# EAGLE design keychain_rev4 (EAGLE 9.6.2)
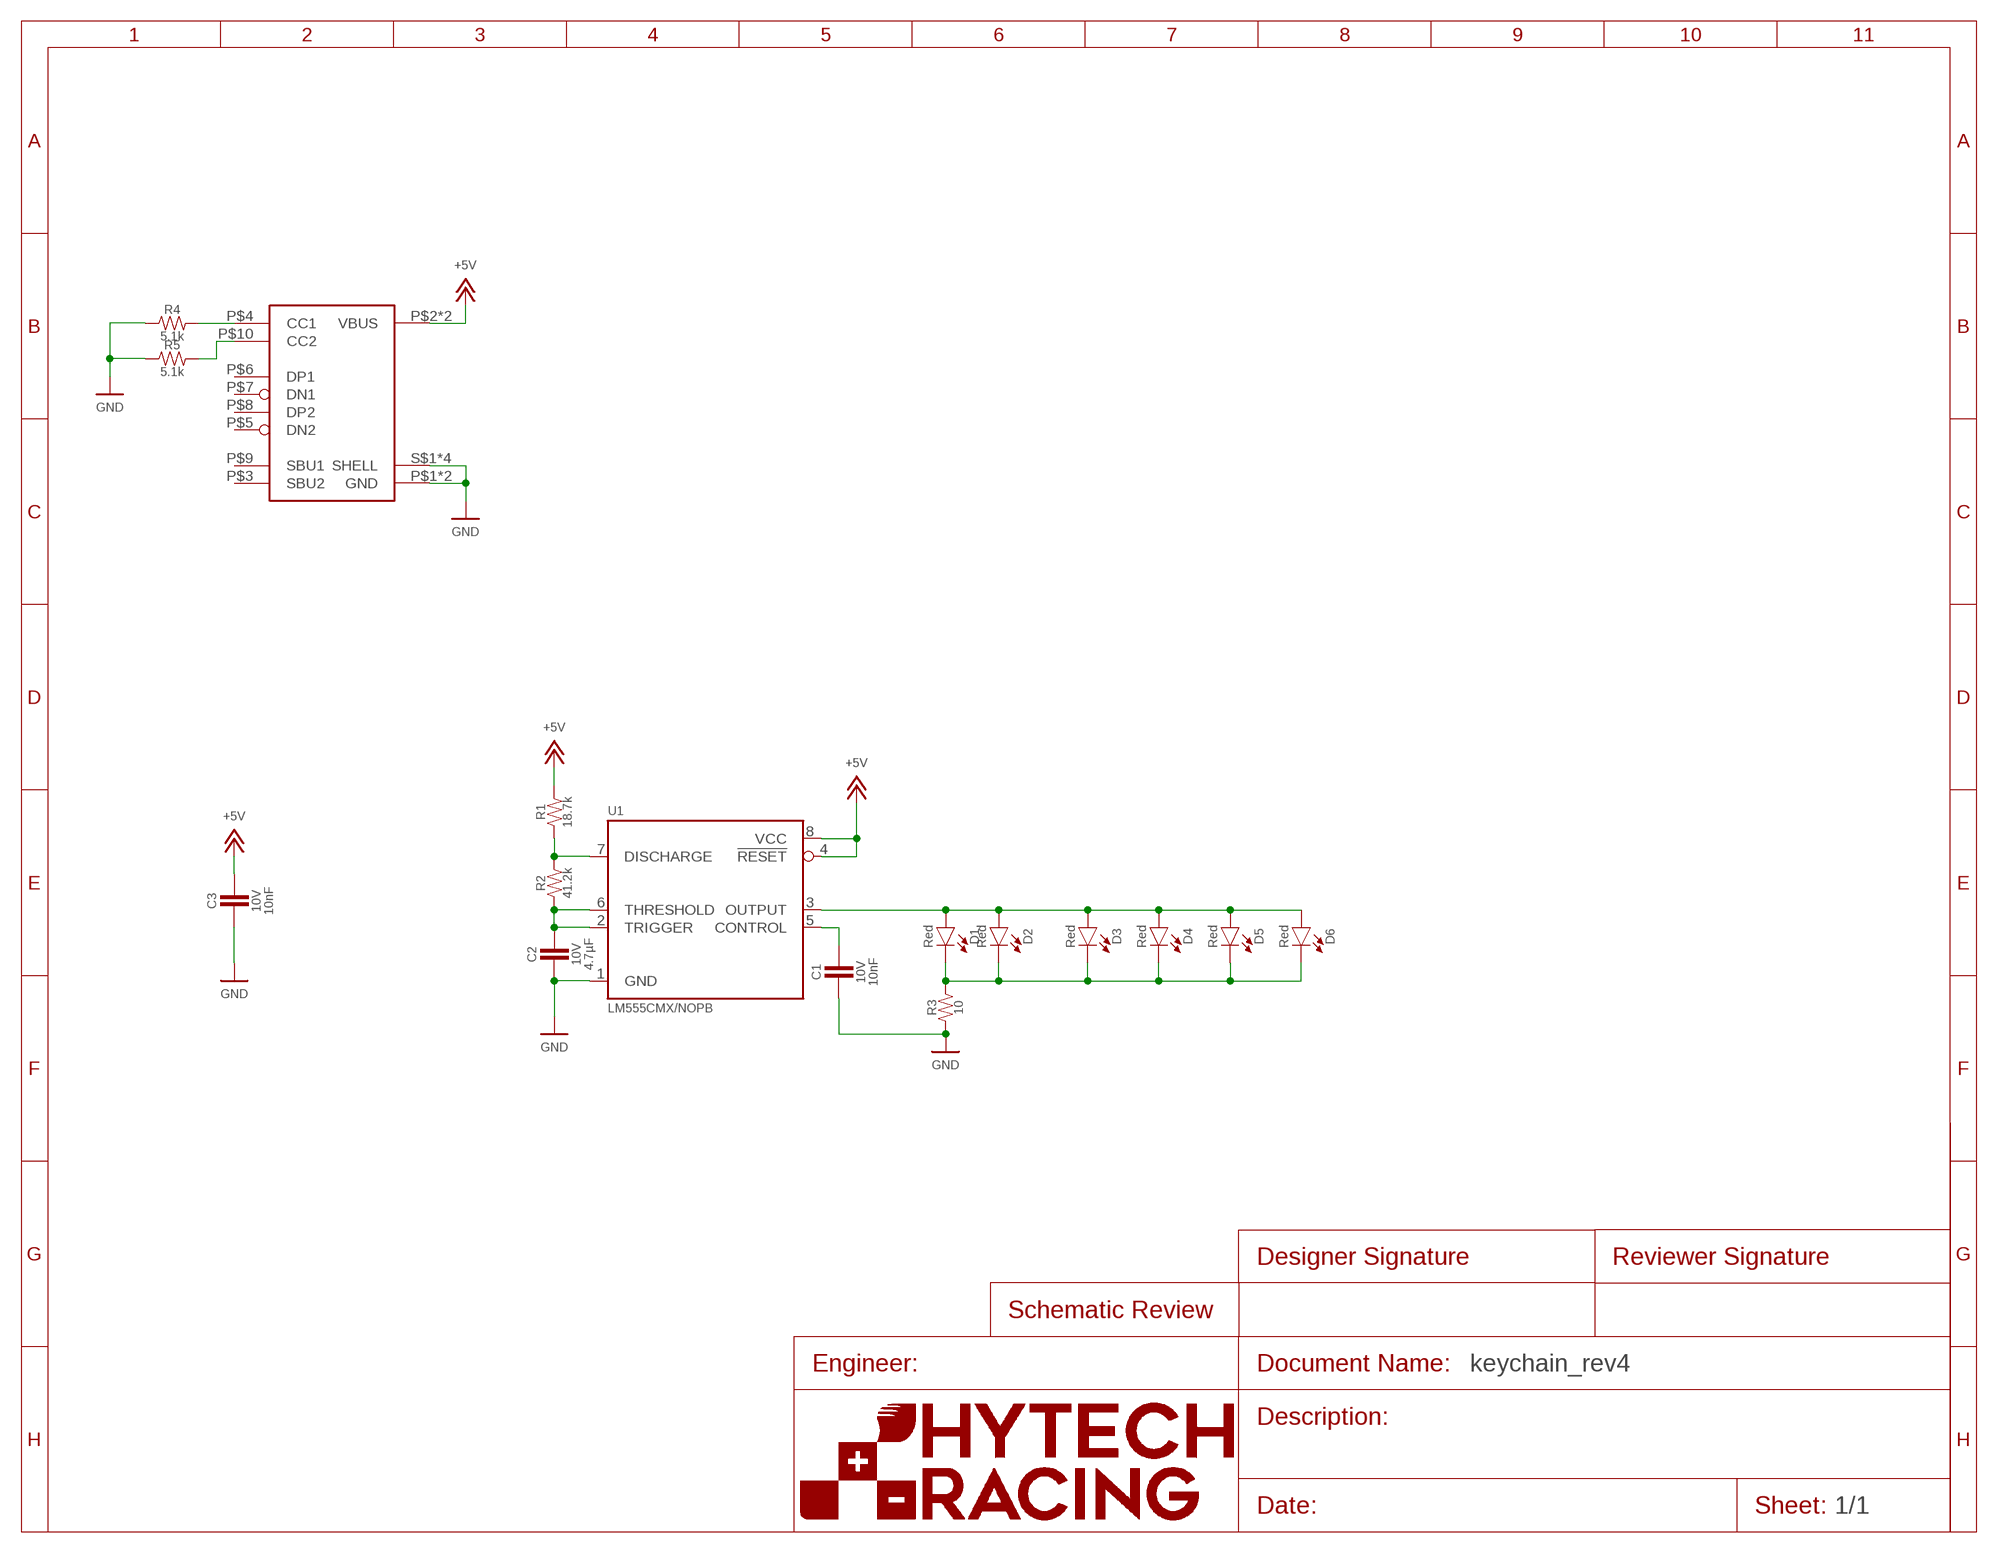
[diagram p0: schematic, sheet 1]

## Parts
C1  CAPACITOR_0603_10V_10NF  [0603-CAP]
C2  CAPACITOR_0603_10V_4.7UF  [0603-CAP]
C3  CAPACITOR_0603_10V_10NF  [0603-CAP]
D1  LED_0603_RED  [0603-LED]
D2  LED_0603_RED  [0603-LED]
D3  LED_0603_RED  [0603-LED]
D4  LED_0603_RED  [0603-LED]
D5  LED_0603_RED  [0603-LED]
D6  LED_0603_RED  [0603-LED]
J1  USB4110  [USB4110]
R1  RESISTOR_0603_18.7K  [0603-RES]
R2  RESISTOR_0603_41.2K  [0603-RES]
R3  RESISTOR_0603_10  [0603-RES]
R4  RESISTOR_0603_5.1K  [0603-RES]
R5  RESISTOR_0603_5.1K  [0603-RES]
U1  LM555  [SOIC-08(NARROW,0.15")]

## Nets
+5V: C3.1 J1.P$2(VBUS) J1.P$11(VBUS) R1.2 U1.4(!RESET) U1.8(VCC)
GND: C1.2 C2.2 C3.2 J1.P$1(GND) J1.P$12(GND) J1.S$1(SHELL) J1.S$2(SHELL) J1.S$3(SHELL) J1.S$4(SHELL) R3.1 R4.1 R5.1 U1.1(GND)
N$1: C1.1 U1.5(CONTROL)
N$2: D1.2(A) D2.2(A) D3.2(A) D4.2(A) D5.2(A) D6.2(A) U1.3(OUTPUT)
N$3: D1.1(C) D2.1(C) D3.1(C) D4.1(C) D5.1(C) D6.1(C) R3.2
N$4: J1.P$4(CC1) R4.2
N$5: J1.P$10(CC2) R5.2
N$6: C2.1 R2.1 U1.2(TRIGGER) U1.6(THRESHOLD)
N$8: R1.1 R2.2 U1.7(DISCHARGE)
Unconnected: J1.P$3(SBU2) J1.P$5(DN2) J1.P$6(DP1) J1.P$7(DN1) J1.P$8(DP2) J1.P$9(SBU1)

## Library data of the parts
C1 C3 = HyTechDevices:CAPACITOR_?_*: Capacitor, Non-Polarized VJ...1BC Series Datasheet <https://www.mouser.com/datasheet/2/427/vjw1bcbascomseries-1762447.pdf> Samsung Datasheet <https://www.mouser.com/datasheet/2/585/MLCC-1837944.pdf> Samsung Automotive MLCC Datasheet <https://www.mouser.com/datasheet/2/585/MLCC_Automotive-1837966.pdf> Walsin Datasheet <https://www.mouser.com/datasheet/2/210/WTC_MLCC_General_Purpose-1534899.pdf> GRM188R61A226ME15D <https://www.mouser.com/datasheet/2/281/1/GRM188R61A226ME15_02A-1985787.pdf> GRM188R61E106MA73D <https://www.mouser.com/datasheet/2/281/1/GRM188R61E106MA73_01A-1985806.pdf> 885012006013 <https://www.mouser.com/datasheet/2/445/885012006013-1726946.pdf> 2220Y6300105KXTWS2 <https://www.mouser.com/datasheet/2/218/SMD_High_and_Std_StackiCap_P62-1825512.pdf> Yageo Class 2, X5R <https://www.mouser.com/datasheet/2/447/UPY_GPHC_X5R_4V_to_50V_26-1827097.pdf> TDK C Series <https://www.mouser.com/ProductDetail/TDK/C3216X5R1V226M160AC?qs=%2Fha2pyFadujbcx9jh7lYl%2F4NeMoXFhdc8AqVWNq4wW6M2y7zl6GzBuhgtI0ngznN> AVX Automotive MLCC <https://www.mouser.com/datasheet/2/40/AutoMLCC-777028.pdf> KEMET X7R Series <https://www.mouser.com/datasheet/2/212/KEM_C1002_X7R_SMD-1102033.pdf> Kyocera AVX <https://www.mouser.com/datasheet/2/40/C0GNP0_Dielectric-951274.pdf> GRM21BR61H <https://www.mouser.com/datasheet/2/281/1/GRM21BR61H106KE43_01A-1986884.pdf> C1812W104KDRACTU <https://www.mouser.com/datasheet/2/212/KEM_C1034_X7R_HV_ARC_SMD-1101730.pdf> CGA series - MLCC Automotive grade <https://product.tdk.com/system/files/dam/doc/product/capacitor/ceramic/mlcc/catalog/mlcc_automotive_general_en.pdf>; CAPACITANCE: 10nF; DKPN: 311-4054-1-ND; MANUFACTURER: Yageo; MOPN: 603-CC603KRX7R6BB103; MPN: CC0603KRX7R6BB103; TOLERANCE: 10%; VOLTAGE: 10V
C2 = HyTechDevices:CAPACITOR_?_*: Capacitor, Non-Polarized VJ...1BC Series Datasheet <https://www.mouser.com/datasheet/2/427/vjw1bcbascomseries-1762447.pdf> Samsung Datasheet <https://www.mouser.com/datasheet/2/585/MLCC-1837944.pdf> Samsung Automotive MLCC Datasheet <https://www.mouser.com/datasheet/2/585/MLCC_Automotive-1837966.pdf> Walsin Datasheet <https://www.mouser.com/datasheet/2/210/WTC_MLCC_General_Purpose-1534899.pdf> GRM188R61A226ME15D <https://www.mouser.com/datasheet/2/281/1/GRM188R61A226ME15_02A-1985787.pdf> GRM188R61E106MA73D <https://www.mouser.com/datasheet/2/281/1/GRM188R61E106MA73_01A-1985806.pdf> 885012006013 <https://www.mouser.com/datasheet/2/445/885012006013-1726946.pdf> 2220Y6300105KXTWS2 <https://www.mouser.com/datasheet/2/218/SMD_High_and_Std_StackiCap_P62-1825512.pdf> Yageo Class 2, X5R <https://www.mouser.com/datasheet/2/447/UPY_GPHC_X5R_4V_to_50V_26-1827097.pdf> TDK C Series <https://www.mouser.com/ProductDetail/TDK/C3216X5R1V226M160AC?qs=%2Fha2pyFadujbcx9jh7lYl%2F4NeMoXFhdc8AqVWNq4wW6M2y7zl6GzBuhgtI0ngznN> AVX Automotive MLCC <https://www.mouser.com/datasheet/2/40/AutoMLCC-777028.pdf> KEMET X7R Series <https://www.mouser.com/datasheet/2/212/KEM_C1002_X7R_SMD-1102033.pdf> Kyocera AVX <https://www.mouser.com/datasheet/2/40/C0GNP0_Dielectric-951274.pdf> GRM21BR61H <https://www.mouser.com/datasheet/2/281/1/GRM21BR61H106KE43_01A-1986884.pdf> C1812W104KDRACTU <https://www.mouser.com/datasheet/2/212/KEM_C1034_X7R_HV_ARC_SMD-1101730.pdf> CGA series - MLCC Automotive grade <https://product.tdk.com/system/files/dam/doc/product/capacitor/ceramic/mlcc/catalog/mlcc_automotive_general_en.pdf>; CAPACITANCE: 4.7µF; DKPN: 1276-1044-1-ND; MANUFACTURER: Samsung Electro-Mechanics; MOPN: 187-CL10A475KP8NNNC; MPN: CL10A475KP8NNNC; TOLERANCE: 10%; VOLTAGE: 10V
D1-D6 = HyTechDevices:LED_?_*: LED 0603 Blue <https://www.mouser.com/datasheet/2/216/APT1608VBC_D-246010.pdf> Green <https://www.mouser.com/datasheet/2/216/APT1608ZGCK-1173388.pdf> Orange <https://www.mouser.com/datasheet/2/216/APT1608SECK-6197.pdf> Red <https://www.mouser.com/datasheet/2/216/APT1608SECK-J3-PRV-1173336.pdf> White <https://www.mouser.com/datasheet/2/50/SM0603UWC-880813.pdf> Yellow <https://www.mouser.com/datasheet/2/216/APT1608SYCK-J3-PRV-1173311.pdf> 2835 (Series not on Digikey) Lumiled LUXEON 2835 Color Line <https://www.mouser.com/datasheet/2/602/DS236_luxeon_2835_color_line_datasheet-1596094.pdf>; COLOR: Red; DKPN: 754-1786-1-ND; MANUFACTURER: Kingbright; MOPN: 604-APT1608SECKJ3PRV; MPN: APT1608SECK/J3-PRV
J1 = HyTechDevices:USB4110: USB4110 USB-C Conenctor Datasheet <https://gct.co/Files/Drawings/USB4110.pdf?v=9c3521e1-ea1e-4753-bd59-adae5023b7f4>; DKPN: 2073-USB4110-GF-A-1-ND; MANUFACTURER: GCT; MOPN: 640-USB4110-GF-A; MPN: USB4110
R1 = HyTechDevices:RESISTOR_?_*: Resistor PWR163 Series <https://www.mouser.com/datasheet/2/54/pwr163-777985.pdf> AC Series <https://www.mouser.com/datasheet/2/447/Yageo_PYu_AC_51_RoHS_L_7_1714230-1874691.pdf> PU Series <https://www.mouser.com/datasheet/2/447/PYu-PU_51_RoHS_L_6-1504619.pdf> UCR Series <https://fscdn.rohm.com/en/products/databook/datasheet/passive/resistor/chip_resistor/ucr-e.pdf> ERA Series <https://www.mouser.com/datasheet/2/315/AOA0000C307-1149632.pdf> PWR263 Series <https://www.mouser.com/datasheet/2/54/pwr263s_35-778069.pdf> KTR Series <https://www.mouser.com/datasheet/2/348/ROHM_S_A0011075115_1-2563276.pdf> RC Series <https://www.mouser.com/datasheet/2/447/Yageo_03_18_2021_PYu_RC_Group_51_RoHS_L_11-2199992.pdf> ERJ Low Resistance Series <https://www.mouser.com/datasheet/2/315/AOA0000C313-1141758.pdf> ERJ PB3, PB6 Series <https://www.mouser.com/datasheet/2/315/AOA0000C328-1530132.pdf> ERJ PA2, P03, PA3, P06, P08, P14 Series <https://www.mouser.com/datasheet/2/315/AOA0000C331-1141874.pdf> B20 Series <https://www.ohmite.com/assets/docs/res_200.pdf?r=false> TE Connectivity/Holsworthy RN73 Series <https://www.mouser.com/datasheet/2/418/4/NG_DS_1773270_M-604713.pdf> Vishay Dale D/CRCW e3 <https://www.mouser.com/datasheet/2/427/dcrcwe3-1762152.pdf> Ohmite B20 <https://www.ohmite.com/assets/docs/res_200.pdf?r=false>; DKPN: 311-18.7KHRCT-ND; MANUFACTURER: Yageo; MOPN: 603-RC0603FR-0718K7L; MPN: RC0603FR-0718K7L; POWER: 0.1W; RESISTANCE: 18.7k; TOLERANCE: 1%; VOLTAGE_CONTINUOUS: 43.24V; VOLTAGE_MAX: 75V
R2 = HyTechDevices:RESISTOR_?_*: Resistor PWR163 Series <https://www.mouser.com/datasheet/2/54/pwr163-777985.pdf> AC Series <https://www.mouser.com/datasheet/2/447/Yageo_PYu_AC_51_RoHS_L_7_1714230-1874691.pdf> PU Series <https://www.mouser.com/datasheet/2/447/PYu-PU_51_RoHS_L_6-1504619.pdf> UCR Series <https://fscdn.rohm.com/en/products/databook/datasheet/passive/resistor/chip_resistor/ucr-e.pdf> ERA Series <https://www.mouser.com/datasheet/2/315/AOA0000C307-1149632.pdf> PWR263 Series <https://www.mouser.com/datasheet/2/54/pwr263s_35-778069.pdf> KTR Series <https://www.mouser.com/datasheet/2/348/ROHM_S_A0011075115_1-2563276.pdf> RC Series <https://www.mouser.com/datasheet/2/447/Yageo_03_18_2021_PYu_RC_Group_51_RoHS_L_11-2199992.pdf> ERJ Low Resistance Series <https://www.mouser.com/datasheet/2/315/AOA0000C313-1141758.pdf> ERJ PB3, PB6 Series <https://www.mouser.com/datasheet/2/315/AOA0000C328-1530132.pdf> ERJ PA2, P03, PA3, P06, P08, P14 Series <https://www.mouser.com/datasheet/2/315/AOA0000C331-1141874.pdf> B20 Series <https://www.ohmite.com/assets/docs/res_200.pdf?r=false> TE Connectivity/Holsworthy RN73 Series <https://www.mouser.com/datasheet/2/418/4/NG_DS_1773270_M-604713.pdf> Vishay Dale D/CRCW e3 <https://www.mouser.com/datasheet/2/427/dcrcwe3-1762152.pdf> Ohmite B20 <https://www.ohmite.com/assets/docs/res_200.pdf?r=false>; DKPN: P20155CT-ND; MANUFACTURER: Panasonic Electronic Components; MOPN: 667-ERJ-PB3B4122V; MPN: ERJ-PB3B4122V; POWER: 0.2W; RESISTANCE: 41.2k; TOLERANCE: 0.1%; VOLTAGE_CONTINUOUS: 150V; VOLTAGE_MAX: 200V
R3 = HyTechDevices:RESISTOR_?_*: Resistor PWR163 Series <https://www.mouser.com/datasheet/2/54/pwr163-777985.pdf> AC Series <https://www.mouser.com/datasheet/2/447/Yageo_PYu_AC_51_RoHS_L_7_1714230-1874691.pdf> PU Series <https://www.mouser.com/datasheet/2/447/PYu-PU_51_RoHS_L_6-1504619.pdf> UCR Series <https://fscdn.rohm.com/en/products/databook/datasheet/passive/resistor/chip_resistor/ucr-e.pdf> ERA Series <https://www.mouser.com/datasheet/2/315/AOA0000C307-1149632.pdf> PWR263 Series <https://www.mouser.com/datasheet/2/54/pwr263s_35-778069.pdf> KTR Series <https://www.mouser.com/datasheet/2/348/ROHM_S_A0011075115_1-2563276.pdf> RC Series <https://www.mouser.com/datasheet/2/447/Yageo_03_18_2021_PYu_RC_Group_51_RoHS_L_11-2199992.pdf> ERJ Low Resistance Series <https://www.mouser.com/datasheet/2/315/AOA0000C313-1141758.pdf> ERJ PB3, PB6 Series <https://www.mouser.com/datasheet/2/315/AOA0000C328-1530132.pdf> ERJ PA2, P03, PA3, P06, P08, P14 Series <https://www.mouser.com/datasheet/2/315/AOA0000C331-1141874.pdf> B20 Series <https://www.ohmite.com/assets/docs/res_200.pdf?r=false> TE Connectivity/Holsworthy RN73 Series <https://www.mouser.com/datasheet/2/418/4/NG_DS_1773270_M-604713.pdf> Vishay Dale D/CRCW e3 <https://www.mouser.com/datasheet/2/427/dcrcwe3-1762152.pdf> Ohmite B20 <https://www.ohmite.com/assets/docs/res_200.pdf?r=false>; DKPN: 311-10.0HRCT-ND; MANUFACTURER: Yageo; MOPN: 603-RC0603FR-0710RL; MPN: RC0603FR-0710RL; POWER: 0.1W; RESISTANCE: 10; TOLERANCE: 1%; VOLTAGE_CONTINUOUS: 1.00V; VOLTAGE_MAX: 75V
R4 R5 = HyTechDevices:RESISTOR_?_*: Resistor PWR163 Series <https://www.mouser.com/datasheet/2/54/pwr163-777985.pdf> AC Series <https://www.mouser.com/datasheet/2/447/Yageo_PYu_AC_51_RoHS_L_7_1714230-1874691.pdf> PU Series <https://www.mouser.com/datasheet/2/447/PYu-PU_51_RoHS_L_6-1504619.pdf> UCR Series <https://fscdn.rohm.com/en/products/databook/datasheet/passive/resistor/chip_resistor/ucr-e.pdf> ERA Series <https://www.mouser.com/datasheet/2/315/AOA0000C307-1149632.pdf> PWR263 Series <https://www.mouser.com/datasheet/2/54/pwr263s_35-778069.pdf> KTR Series <https://www.mouser.com/datasheet/2/348/ROHM_S_A0011075115_1-2563276.pdf> RC Series <https://www.mouser.com/datasheet/2/447/Yageo_03_18_2021_PYu_RC_Group_51_RoHS_L_11-2199992.pdf> ERJ Low Resistance Series <https://www.mouser.com/datasheet/2/315/AOA0000C313-1141758.pdf> ERJ PB3, PB6 Series <https://www.mouser.com/datasheet/2/315/AOA0000C328-1530132.pdf> ERJ PA2, P03, PA3, P06, P08, P14 Series <https://www.mouser.com/datasheet/2/315/AOA0000C331-1141874.pdf> B20 Series <https://www.ohmite.com/assets/docs/res_200.pdf?r=false> TE Connectivity/Holsworthy RN73 Series <https://www.mouser.com/datasheet/2/418/4/NG_DS_1773270_M-604713.pdf> Vishay Dale D/CRCW e3 <https://www.mouser.com/datasheet/2/427/dcrcwe3-1762152.pdf> Ohmite B20 <https://www.ohmite.com/assets/docs/res_200.pdf?r=false>; DKPN: 311-5.10KHRTR-ND; MANUFACTURER: Yageo; MOPN: 603-RC0603FR-075K1L; MPN: RC0603FR-075K1L; POWER: 0.1W; RESISTANCE: 5.1k; TOLERANCE: 1%; VOLTAGE_CONTINUOUS: 22.58V; VOLTAGE_MAX: 75V
U1 = HyTechDevices:*555: **555 Precision Timer NA555, NE555, SA555, SE555 <https://www.ti.com/lit/ds/symlink/na555.pdf> LM555 <https://www.ti.com/lit/ds/symlink/lm555.pdf>; DKPN: LM555CMX/NOPBCT-ND; MANUFACTURER: Texas Instruments; MOPN: 926-LM555CMX/NOPB; MPN: LM555CMX/NOPB

## Board
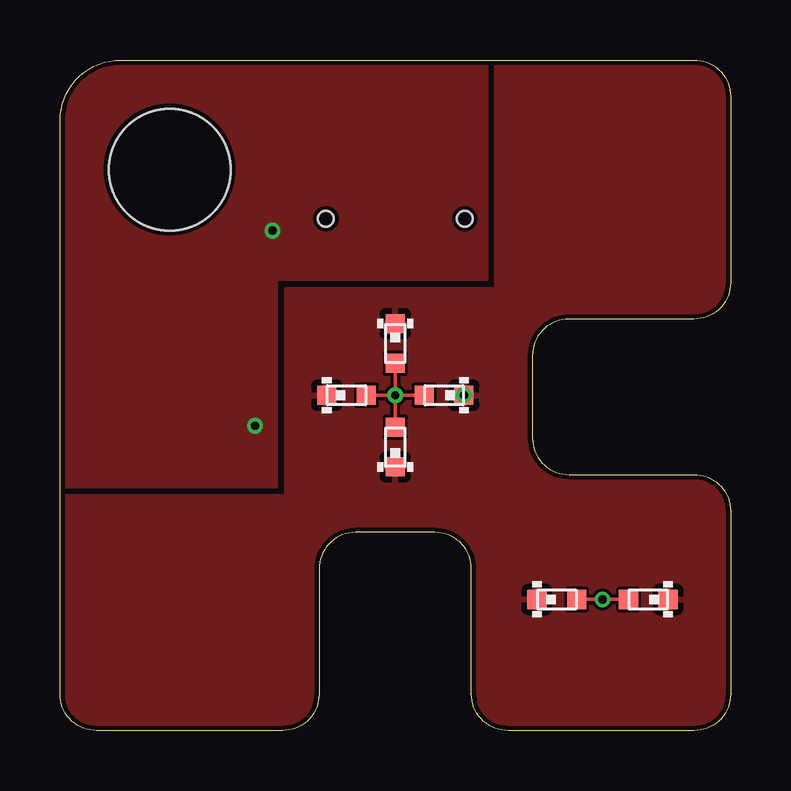
[diagram p1: board, top side]
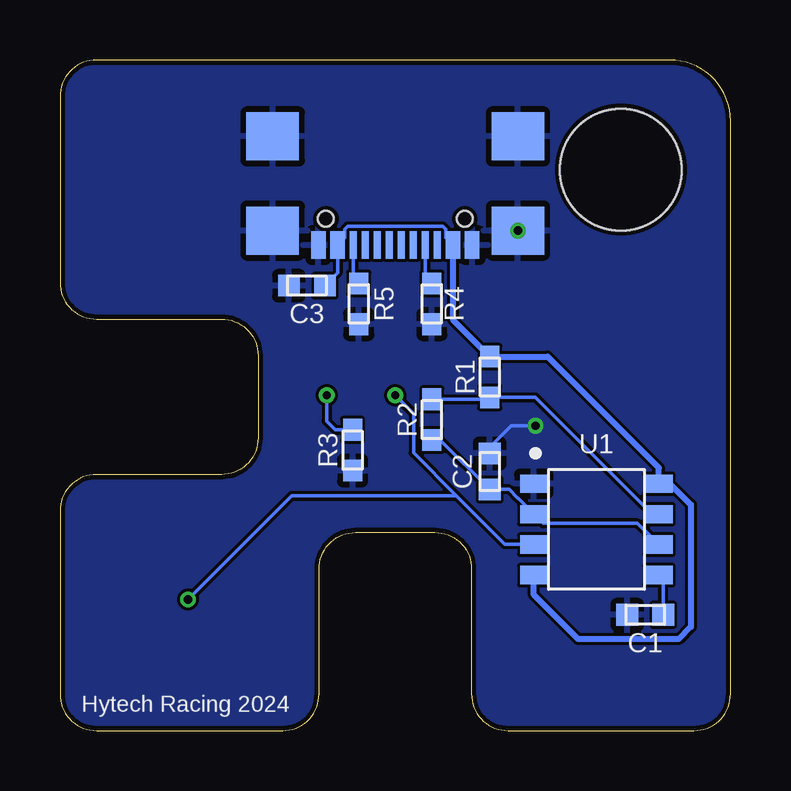
[diagram p2: board, bottom side, seen from below]

Size 27.94 x 27.94 mm. Coordinates in mm from the lower left corner, seen from the top.
Outline: 27.94,9.14 27.94,1.52 arc-90 26.42,0 18.67,0 arc-90 17.14,1.52 17.14,6.73 arc90 15.62,8.26 12.32,8.26 arc90 10.79,6.73 10.79,1.52 arc-90 9.27,0 1.52,0 arc-90 0,1.52 0,25.4 arc-90 2.54,27.94 26.42,27.94 arc-90 27.94,26.42 27.94,18.67 arc-90 26.42,17.14 21.21,17.14 arc90 19.68,15.62 19.68,12.19 arc90 21.21,10.67 26.42,10.67 arc-90 27.94,9.14
Copper layers (1*16): Top 0.035mm / dielectric 1.53mm / Bottom 0.035mm
Design rules "JLCPCB (2 Layer)": minimum track width 5mil, minimum drill 0.3mm, track to track 5mil, track to pad 5mil, pad to pad 5mil, via to via 20mil, smd to smd 5mil, copper to edge 0.2mm, drill to drill 21mil, minimum pad ring 6mil, minimum via ring 6mil, stop-mask expansion 6mil, vias tented up to drill 30mil, thermal gap 10mil
Holes 5.08 mm at 4.57,23.37

### Footprints (pad centres in the part's own frame; a part is rotated, then mirrored left to right if it is on the bottom)
0603-CAP = smd 0.9 x 0.9: 1 -0.75,0; 2 0.75,0
0603-LED = smd 0.8 x 0.8: 1 -0.825,0; 2 0.825,0
USB4110 = smd 0.6 x 1.15: P$1 -3.2,0.6; P$2 -2.4,0.6; P$11 2.4,0.6; P$12 3.2,0.6 | smd 0.3 x 1.15: P$3 -1.75,0.6; P$4 -1.25,0.6; P$5 -0.75,0.6; P$6 -0.25,0.6; P$7 0.25,0.6; P$8 0.75,0.6; P$9 1.25,0.6; P$10 1.75,0.6 | smd 2.18 x 2: S$1 -5.11,0; S$2 5.11,0; S$3 -5.11,-3.93; S$4 5.11,-3.93 | hole 0.65: -2.89,-0.5; 2.89,-0.5
0603-RES = smd 0.9 x 0.8: 1 -0.85,0; 2 0.85,0
SOIC-08(NARROW,0.15") = smd 0.762 x 1.143: 1 -1.905,-2.603; 2 -0.635,-2.603; 3 0.635,-2.603; 4 1.905,-2.603; 5 1.905,2.603; 6 0.635,2.603; 7 -0.635,2.603; 8 -1.905,2.603

### Placement (x,y rotation side)
C1  3.56,4.83 180 bottom
C2  10.03,10.79 90 bottom
C3  17.65,18.54 180 bottom
D1  13.97,16.13 270 top
D2  16,13.97 180 top
D3  11.94,13.97 0 top
D4  13.97,11.81 90 top
D5  24.51,5.46 180 top
D6  20.7,5.46 0 top
J1  13.97,20.83 180 bottom
R1  10.03,14.73 90 bottom
R2  12.45,12.95 90 bottom
R3  15.75,11.68 90 bottom
R4  12.45,17.78 90 bottom
R5  15.49,17.78 90 bottom
U1  5.59,8.38 270 bottom

### Tracks (layer width: path | path; a pad name or v marks a point on that pad's centre or on a via)
+5V
  Bottom 0.152: C3.1 16.37,19.07 J1.P$11 16.07,20.52 16.07,20.89 15.95,21.01 11.99,21.01 11.87,20.89 11.87,20.52 J1.P$2
  Bottom 0.254: J1.P$2 11.57,17.12 R1.2 7.62,15.58 2.98,10.95 U1.8 2.53,10.29 1.65,9.41 1.65,4.32 2.16,3.81 6.35,3.81 8.19,5.65 U1.4
GND  (via drill 0.35)
  Bottom 0.152: C2.2 10.03,11.8 9.13,12.7 v8.13,12.7
  other vias: 8.86,20.83
  pour Bottom: -0.38,-0.38 28.45,-0.38 28.45,28.32 -0.38,28.32
  pour Top: -0.13,10.16 9.02,10.16 9.02,18.8 17.78,18.8 17.78,28.07 -0.13,28.07
N$1
  Bottom 0.152: C1.1 2.81,6.3 U1.5
N$2  (via drill 0.35)
  Top 0.152: D3.2 v13.97,13.97 | D2.2 v13.97,13.97 | D1.2 v13.97,13.97 | D4.2 v13.97,13.97 | D6.2 v22.61,5.46 D5.2
  Bottom 0.152: U1.3 8.22,7.77 9.41,7.77 11.42,9.78 | 11.42,9.78 13.21,11.57 13.21,13.21 v13.97,13.97 | v22.61,5.46 18.29,9.78 11.42,9.78
N$3  (via drill 0.35)
  Bottom 0.152: D2.1 16.83,12.89 16.47,12.53 R3.2
  other vias: 16.83,13.97
  pour Top: -0.13,9.78 -0.13,-0.13 28.07,-0.13 28.19,0 28.19,28.07 18.16,28.07 18.16,18.41 9.4,18.41 9.4,9.78
N$4
  Bottom 0.152: J1.P$4 12.72,18.9 R4.2
N$5
  Bottom 0.152: J1.P$10 15.72,18.86 R5.2
N$6
  Bottom 0.152: R2.1 12.09,12.1 C2.1 9.22,10.04 8.86,9.68 8.85,9.68 U1.2 7.81,8.64 3.88,8.64 3.65,8.41 U1.6
N$8
  Bottom 0.152: U1.7 3.26,9.02 8.13,13.88 R1.1 10.11,13.8 R2.2

### Text on the board
bPlace: Hytech Racing 2024